# Altium schematic sheet Sheet3.SchDoc
size A3
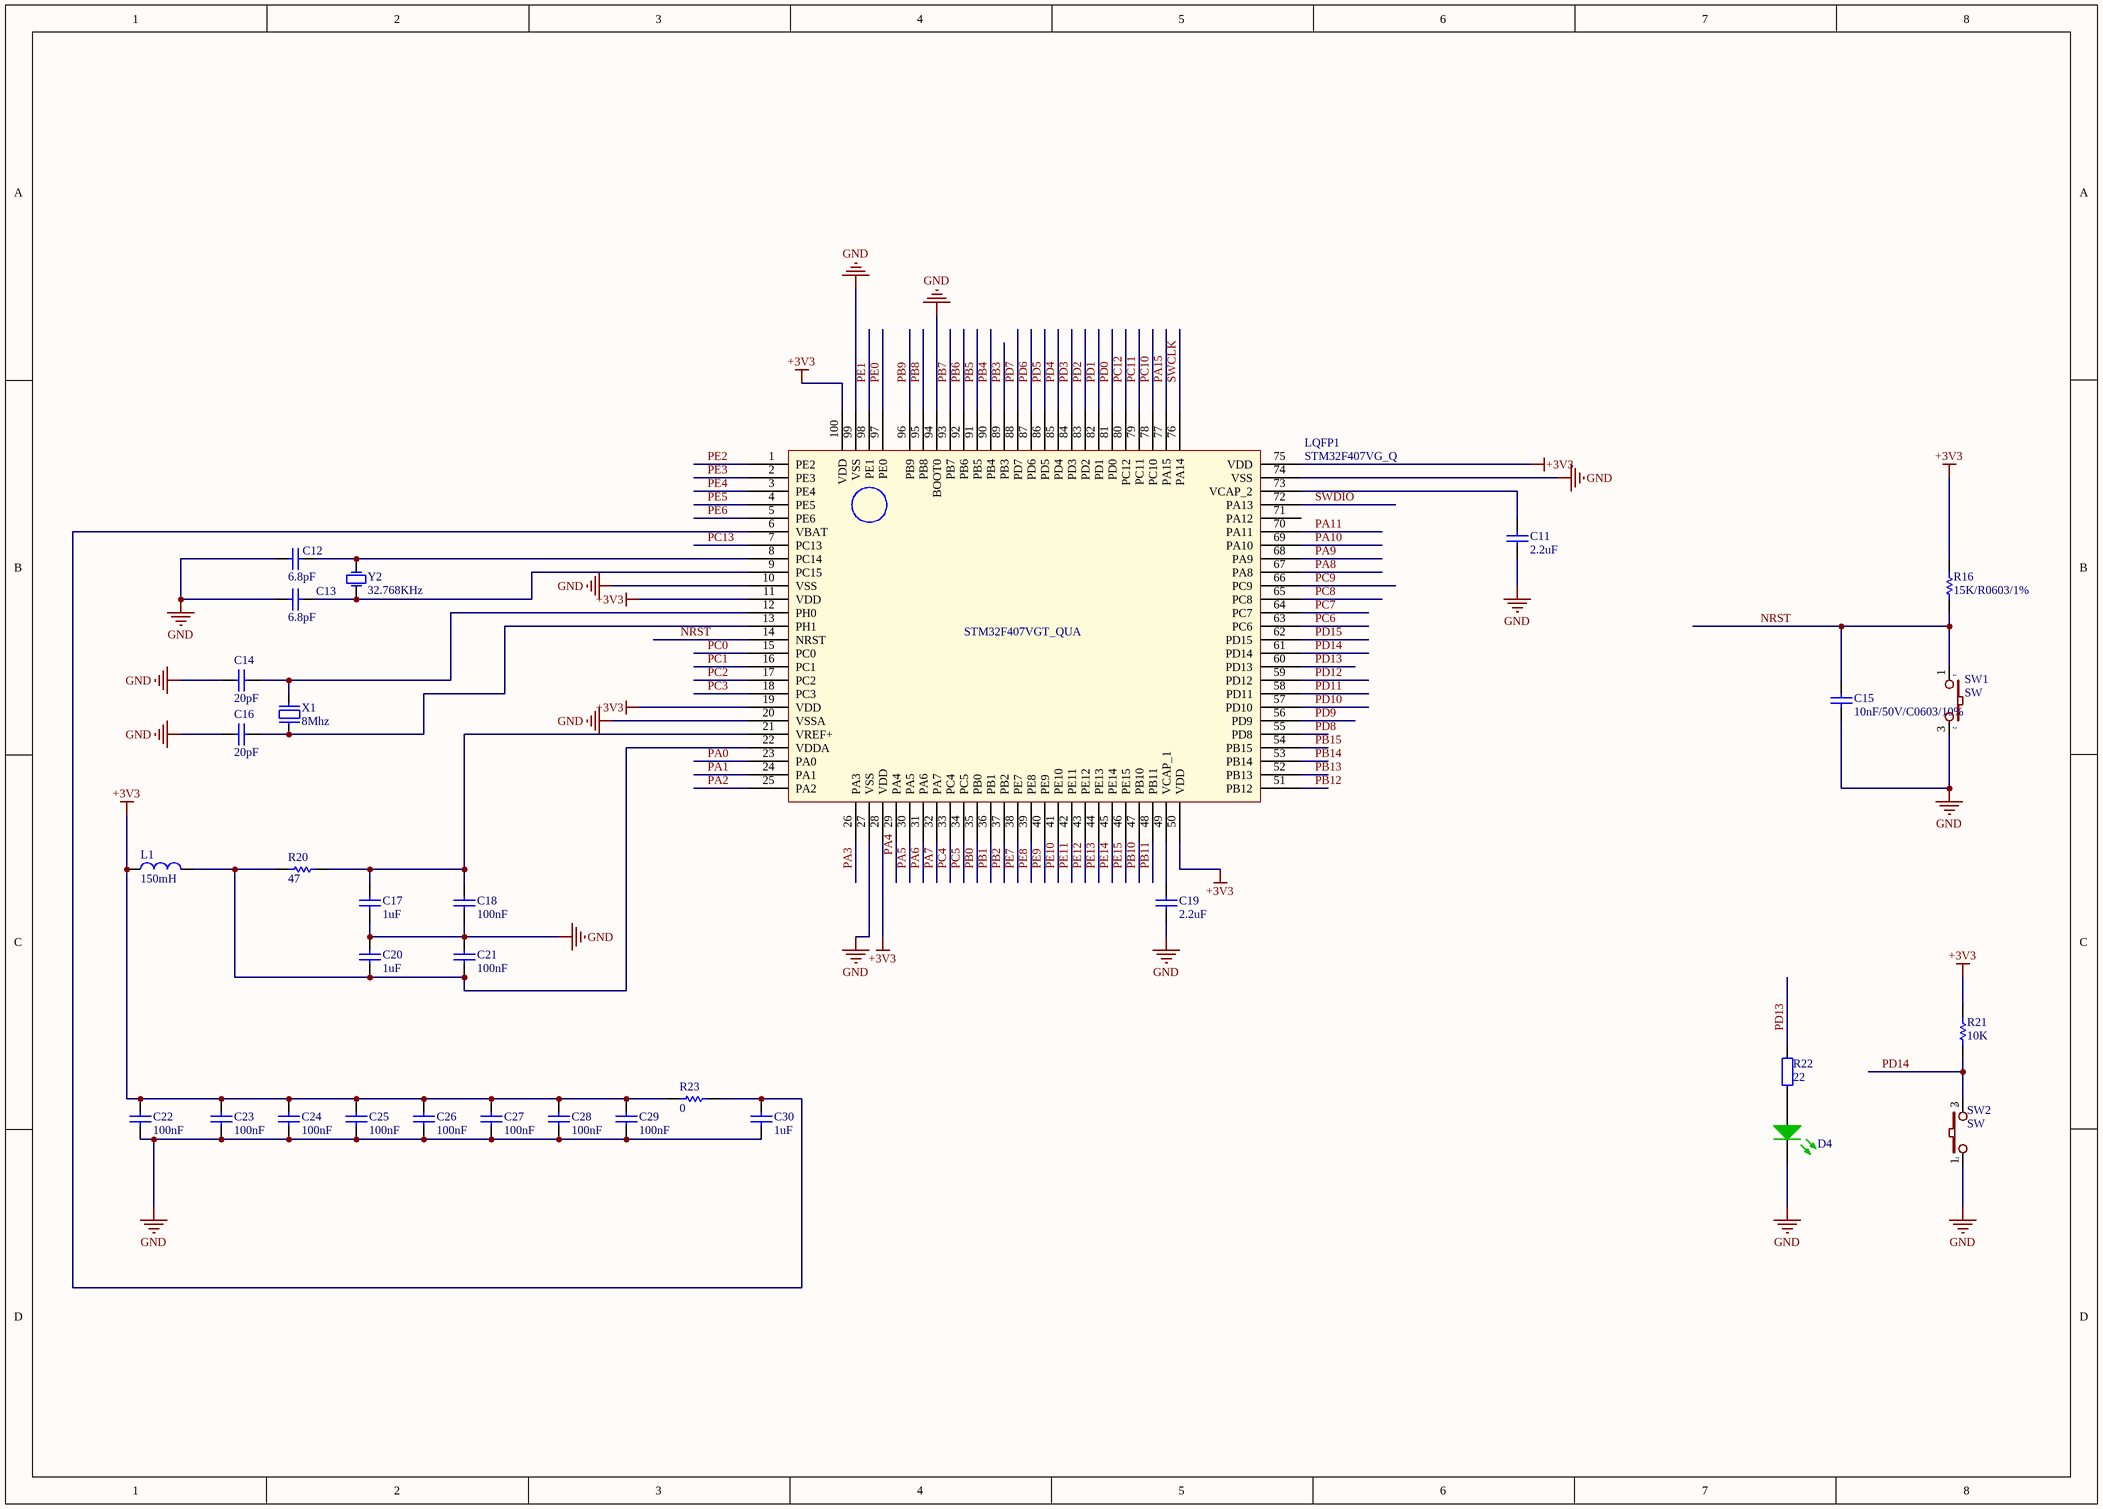
[diagram p0: Sheet3.SchDoc]

## Parts
C11  2.2uF  [Cap Ceramic 0805 SMD]
C12  6.8pF  [Cap Ceramic 0805 SMD]
C13  6.8pF  [Cap Ceramic 0805 SMD]
C14  20pF  [Cap Ceramic 0805 SMD]
C15  10nF/50V/C0603/10%  [Cap Ceramic 0805 SMD]
C16  20pF  [Cap Ceramic 0805 SMD]
C17  1uF  [Cap Ceramic 0805 SMD]
C18  100nF  [Cap Ceramic 0805 SMD]
C19  2.2uF  [Cap Ceramic 0805 SMD]
C20  1uF  [Cap Ceramic 0805 SMD]
C21  100nF  [Cap Ceramic 0805 SMD]
C22  100nF  [Cap Ceramic 0805 SMD]
C23  100nF  [Cap Ceramic 0805 SMD]
C24  100nF  [Cap Ceramic 0805 SMD]
C25  100nF  [Cap Ceramic 0805 SMD]
C26  100nF  [Cap Ceramic 0805 SMD]
C27  100nF  [Cap Ceramic 0805 SMD]
C28  100nF  [Cap Ceramic 0805 SMD]
C29  100nF  [Cap Ceramic 0805 SMD]
C30  1uF  [Cap Ceramic 0805 SMD]
D4  GREEN 0603  [Led 0805G]  (value not drawn)
L1  150mH  [Res 0805 SMD]
LQFP1  STM32F407VG_Q  [STM32F407VG]
R16  15K/R0603/1%  [Res 0805 SMD]
R20  47  [Res 0805 SMD]
R21  10K  [Res 0805 SMD]
R22  value 22  [Res 0805 SMD]  (hidden comment: Res2)
R23  0  [Res 0805 SMD]
SW1  SW  [BUTTON 4 PIN]
SW2  SW  [BUTTON 4 PIN]
X1  8Mhz  [CRYSTAL]
Y2  value 32.768KHz  [CR_32768]  (hidden comment: FC-135R - 32.768KHz)

## Nets
+3V3: C22.2 C23.2 C24.2 C25.2 C26.2 C27.2 C28.2 C29.2 L1.1 LQFP1.11(VDD) LQFP1.19(VDD) LQFP1.28(VDD) LQFP1.50(VDD) LQFP1.75(VDD) LQFP1.100(VDD) R16.2 R21.2 R23.2
GND: C11.1 C12.2 C13.2 C14.2 C15.1 C16.2 C17.1 C18.1 C19.1 C20.2 C21.2 C22.1 C23.1 C24.1 C25.1 C26.1 C27.1 C28.1 C29.1 C30.1 D4.2(K) LQFP1.10(VSS) LQFP1.20(VSSA) LQFP1.27(VSS) LQFP1.74(VSS) LQFP1.94(BOOT0) LQFP1.99(VSS) SW1.3 SW2.1
NRST: C15.2 LQFP1.14(NRST) R16.1 SW1.1
PA0: LQFP1.23(PA0)
PA1: LQFP1.24(PA1)
PA2: LQFP1.25(PA2)
PA3: LQFP1.26(PA3)
PA4: LQFP1.29(PA4)
PA5: LQFP1.30(PA5)
PA6: LQFP1.31(PA6)
PA7: LQFP1.32(PA7)
PA8: LQFP1.67(PA8)
PA9: LQFP1.68(PA9)
PA10: LQFP1.69(PA10)
PA11: LQFP1.70(PA11)
PA15: LQFP1.77(PA15)
PB0: LQFP1.35(PB0)
PB1: LQFP1.36(PB1)
PB2: LQFP1.37(PB2)
PB3: LQFP1.89(PB3)
PB4: LQFP1.90(PB4)
PB5: LQFP1.91(PB5)
PB6: LQFP1.92(PB6)
PB7: LQFP1.93(PB7)
PB8: LQFP1.95(PB8)
PB9: LQFP1.96(PB9)
PB10: LQFP1.47(PB10)
PB11: LQFP1.48(PB11)
PB12: LQFP1.51(PB12)
PB13: LQFP1.52(PB13)
PB14: LQFP1.53(PB14)
PB15: LQFP1.54(PB15)
PC0: LQFP1.15(PC0)
PC1: LQFP1.16(PC1)
PC2: LQFP1.17(PC2)
PC3: LQFP1.18(PC3)
PC4: LQFP1.33(PC4)
PC5: LQFP1.34(PC5)
PC6: LQFP1.63(PC6)
PC7: LQFP1.64(PC7)
PC8: LQFP1.65(PC8)
PC9: LQFP1.66(PC9)
PC10: LQFP1.78(PC10)
PC11: LQFP1.79(PC11)
PC12: LQFP1.80(PC12)
PC13: LQFP1.7(PC13)
PD0: LQFP1.81(PD0)
PD1: LQFP1.82(PD1)
PD2: LQFP1.83(PD2)
PD3: LQFP1.84(PD3)
PD4: LQFP1.85(PD4)
PD5: LQFP1.86(PD5)
PD6: LQFP1.87(PD6)
PD7: LQFP1.88(PD7)
PD8: LQFP1.55(PD8)
PD9: LQFP1.56(PD9)
PD10: LQFP1.57(PD10)
PD11: LQFP1.58(PD11)
PD12: LQFP1.59(PD12)
PD13: LQFP1.60(PD13) R22.1
PD14: LQFP1.61(PD14) R21.1 SW2.3
PD15: LQFP1.62(PD15)
PE0: LQFP1.97(PE0)
PE1: LQFP1.98(PE1)
PE2: LQFP1.1(PE2)
PE3: LQFP1.2(PE3)
PE4: LQFP1.3(PE4)
PE5: LQFP1.4(PE5)
PE6: LQFP1.5(PE6)
PE7: LQFP1.38(PE7)
PE8: LQFP1.39(PE8)
PE9: LQFP1.40(PE9)
PE10: LQFP1.41(PE10)
PE11: LQFP1.42(PE11)
PE12: LQFP1.43(PE12)
PE13: LQFP1.44(PE13)
PE14: LQFP1.45(PE14)
PE15: LQFP1.46(PE15)
SWCLK: LQFP1.76(PA14)
SWDIO: LQFP1.72(PA13)
NetC11_2: C11.2 LQFP1.73(VCAP_2)
NetC12_1: C12.1 LQFP1.8(PC14) Y2.2(OSC2)
NetC13_1: C13.1 LQFP1.9(PC15) Y2.1(OSC1)
NetC14_1: C14.1 LQFP1.12(PH0) X1.2
NetC16_1: C16.1 LQFP1.13(PH1) X1.1
NetC17_2: C17.2 C18.2 LQFP1.21(VREF+) R20.1
NetC19_2: C19.2 LQFP1.49(VCAP_1)
NetC20_1: C20.1 C21.1 L1.2 LQFP1.22(VDDA) R20.2
NetC30_2: C30.2 LQFP1.6(VBAT) R23.1
NetD4_1: D4.1(A) R22.2

Not connected (* = marked no-connect by the designer): LQFP1 71(PA12)

## Notes on the sheet
- (in symbol STM32F407VG_Q) STM32F407VGT_QUA
- (in symbol SW2) 2

## Library data of the parts
C11-C14 C16-C30 = 22pF/50V/C0603/10%: CAP CER 22PF 50V NP0 0603; Manufacturer: Kemet; Manufacturer Part Number: C0603C220K5GACTU; Tolerance: ±10%; Temperature Coefficient: C0G, NP0; RoHS: RoHS Compliant; Category: Capacitors; Packaging: Digi-Reel®; Capacitance: 22pF; Voltage - Rated: 50V; Mounting Type: Surface Mount, MLCC; Operating Temperature: -55°C ~ 125°C; Applications: General Purpose; Ratings: -; Package / Case: 0603 (1608 Metric); Size / Dimension: 0.063" L x 0.031" W (1.60mm x 0.80mm); Height - Seated (Max): -; Thickness (Max): 0.034" (0.87mm); Lead Spacing: -; Features: -; Lead Style: -; ComponentLink1URL: http://www.kemet.com/docfinder?Partnumber=C0603C220K5GACTU; ComponentLink1Description: http://www.kemet.com/docfinder?Partnumber=C0603C220K5GACTU; Supplier 1: Digi-Key; Supplier Part Number 1: 399-7875-1-ND
C15 = 10nF/50V/C0603/10%_1: CAP CER 10000PF 50V X7R 0603; Manufacturer: Murata Electronics North America; Manufacturer Part Number: GRM188R71H103KA01D; Tolerance: ±10%; RoHS: RoHS Compliant; Category: Capacitors; Packaging: Cut Tape (CT); Capacitance: 10000pF; Voltage - Rated: 50V; Temperature Coefficient: X7R; Mounting Type: Surface Mount, MLCC; Operating Temperature: -55°C ~ 125°C; Applications: General Purpose; Ratings: -; Package / Case: 0603 (1608 Metric); Size / Dimension: 0.063" L x 0.031" W (1.60mm x 0.80mm); Height - Seated (Max): -; Thickness (Max): 0.035" (0.90mm); Lead Spacing: -; Features: -; Lead Style: -; ComponentLink1URL: http://www.murata.com/~/media/webrenewal/support/library/catalog/products/capacitor/mlcc/c02e.ashx; ComponentLink1Description: http://www.murata.com/~/media/webrenewal/support/library/catalog/products/capacitor/mlcc/c02e.ashx; Supplier 1: Digi-Key; Supplier Part Number 1: 490-1512-1-ND
D4 = LED GREEN 0603: LED GREEN CLEAR 0603 SMD; Manufacturer: Lite-On Inc.; Manufacturer Part Number: LTST-C190KGKT; Lens Color: Colorless; Millicandela Rating: 35mcd; Lens Style/Size: Rectangle with Flat Top, 1.10mm x 0.80mm; Voltage - Forward (Vf) (Typ): 2V; Current - Test: 20mA; Viewing Angle: 130°; Wavelength - Dominant: 571nm; Wavelength - Peak: 574nm; RoHS: RoHS Compliant; Category: Optoelectronics; Packaging: Cut Tape (CT); Color: Green; Lens Transparency: Clear; Mounting Type: Surface Mount; Features: -; Package / Case: 0603 (1608 Metric); Supplier Device Package: *; Size / Dimension: 1.60mm L x 0.80mm W; Height (Max): 0.80mm; ComponentLink1URL: http://optoelectronics.liteon.com/upload/download/DS22-2000-074/S_110_LTST-C190KGKT.pdf; ComponentLink1Description: http://optoelectronics.liteon.com/upload/download/DS22-2000-074/S_110_LTST-C190KGKT.pdf; Supplier 1: Digi-Key; Supplier Part Number 1: 160-1435-1-ND
L1 = L1: Inductor; Value: 150 mH
R16 R21 = 15K/R0603/1%_1: RES SMD 15K OHM 1% 1/10W 0603; Manufacturer: Yageo; Manufacturer Part Number: RC0603FR-0715KL; Power (Watts): 0.1W, 1/10W; Temperature Coefficient: ±100ppm/°C; RoHS: RoHS Compliant; Category: Resistors; Packaging: Digi-Reel®; Resistance (Ohms): 15k; Tolerance: ±1%; Composition: Thick Film; Features: Moisture Resistant; Operating Temperature: -55°C ~ 155°C; Package / Case: 0603 (1608 Metric); Supplier Device Package: 0603; Size / Dimension: 0.063" L x 0.031" W (1.60mm x 0.80mm); Height: 0.022" (0.55mm); Number of Terminations: 2; ComponentLink1URL: http://www.yageo.com/NewPortal/yageodocoutput?fileName=/pdf/R-Chip/PYu-RC_Group_51_RoHS_L_3.pdf; ComponentLink1Description: http://www.yageo.com/NewPortal/yageodocoutput?fileName=/pdf/R-Chip/PYu-RC_Group_51_RoHS_L_3.pdf; Supplier 1: Digi-Key; Supplier Part Number 1: 311-15.0KHRCT-ND
R20 R23 = 10K/R0603/1%: RES SMD 10K OHM 1% 1/10W 0603; Manufacturer: Yageo; Manufacturer Part Number: RC0603FR-0710KL; Power (Watts): 0.1W, 1/10W; Temperature Coefficient: ±100ppm/°C; Supplier 1: Digi-Key; RoHS: RoHS Compliant; Category: Resistors; Stock 1: 11440000; Pricing 1: 5000=0.00167, 10000=0.00145, 25000=0.00128, 50000=0.00117, 125000=0.00115 (USD); Packaging: Tape & Reel (TR); Resistance (Ohms): 10k; Tolerance: ±1%; Composition: Thick Film; Features: Moisture Resistant; Operating Temperature: -55°C ~ 155°C; Package / Case: 0603 (1608 Metric); Supplier Device Package: 0603; Size / Dimension: 0.063" L x 0.031" W (1.60mm x 0.80mm); Height: 0.022" (0.55mm); Number of Terminations: 2; ComponentLink1URL: http://www.yageo.com/NewPortal/yageodocoutput?fileName=/pdf/R-Chip/PYu-RC_Group_51_RoHS_L_3.pdf; ComponentLink1Description: http://www.yageo.com/NewPortal/yageodocoutput?fileName=/pdf/R-Chip/PYu-RC_Group_51_RoHS_L_3.pdf; Supplier Part Number 1: 311-10.0KHRTR-ND
R22 = Res2: Resistor; Published: 8-Jun-2000; LatestRevisionDate: 17-Jul-2002; LatestRevisionNote: Re-released for DXP Platform.; PackageReference: AXIAL-0.4; Publisher: Altium Limited
SW1 SW2 = SW2: Switch button 2 pin; Value: SW chip 2 pin
X1 = XT32k: Crystal 32,768kHz for timer real; Value: 32,768khz
Y2 = FC-135R - 32.768KHz: Crystal FC-135R - 32.768KHz; ComponentLink1Description: Datasheet; ComponentLink1URL: D:\Dropbox\Datasheets\Passive Components\Crystals\HC49S.pdf; Unit Price: 0.0440